# EAGLE design H05R00 (EAGLE 9.6.2)

## Sheet 1 of 2
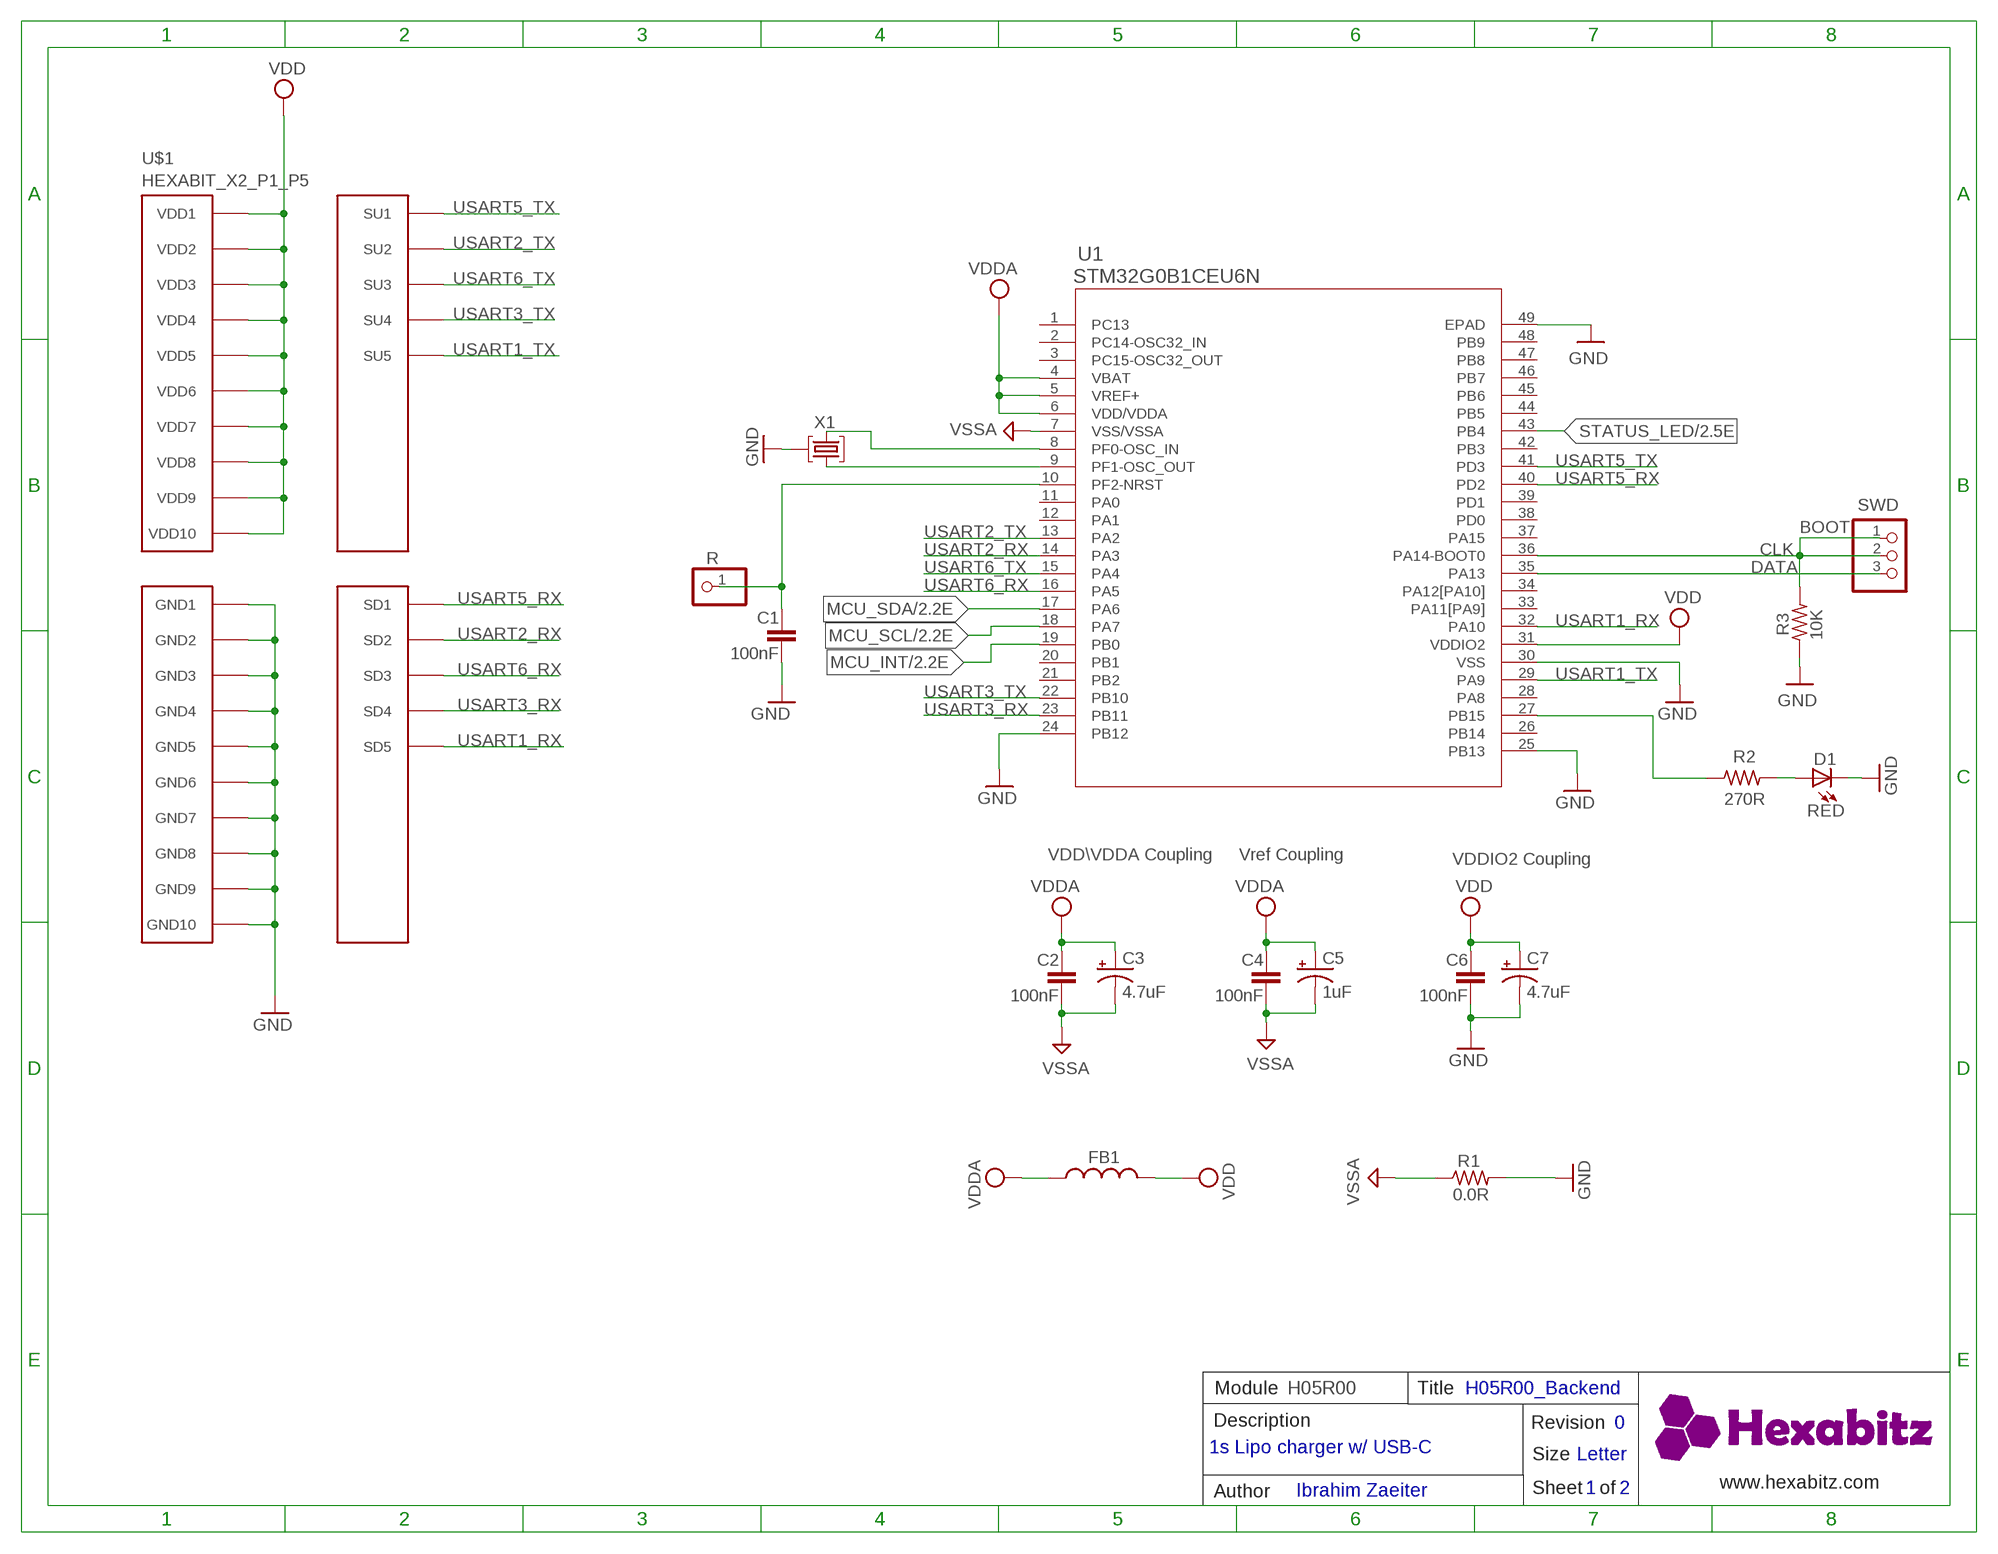
[diagram p0: schematic, sheet 1]

### Parts
C1  100nF  C-0603  [C-0603]
C2  100nF  C-0603  [C-0603]
C3  4.7uF  C-0805-POL  [C-0805-POL]
C4  100nF  C-0603  [C-0603]
C5  1uF  C-0805-POL  [C-0805-POL]
C6  100nF  C-0603  [C-0603]
C7  4.7uF  C-0805-POL  [C-0805-POL]
D1  RED  VLMS1300-GS08  [VLMS1300-GS08]
FB1  FB-0603  [FB-0603]
R  R  PINHD-1X1  [1X01]
R1  0.0R  R-0603  [R-0603]
R2  270R  R-0603  [R-0603]
R3  10K  R-0603  [R-0603]
SWD  PINHD-1X3  [1X03]
U1  STM32G0B1CEU6N  [HEXABITZ_ICS_QFN_B1CEU6_STM-L]
U$1  HEXABIT_X2_P1_P5  [HEXABIT_17.32_X2_P1_P5]
X1  XTALL_CSTCE8M00G52  [XTALL_CSTCE8M00G52]

### Nets
CLK: R3.2 SWD.1 SWD.2 U1.36(PA14-BOOT0)
DATA: SWD.3 U1.35(PA13)
GND: C1.2 C6.2 C7.2(-) D1.C R1.2 R3.1 U1.24(PB12) U1.25(PB13) U1.30(VSS) U1.49(EPAD) U$1.PAD_PD11(GND1) U$1.PAD_PD12(GND2) U$1.PAD_PD13(GND3) U$1.PAD_PD14(GND4) U$1.PAD_PD15(GND5) U$1.PAD_PD16(GND6) U$1.PAD_PD17(GND7) U$1.PAD_PD18(GND8) U$1.PAD_PD19(GND9) U$1.PAD_PD20(GND10) X1.P$2 ; also sheet 2
MCU_INT: U1.19(PB0) ; also sheet 2
MCU_SCL: U1.18(PA7) ; also sheet 2
MCU_SDA: U1.17(PA6) ; also sheet 2
N$1: D1.A R2.2
N$2: R2.1 U1.27(PB15)
N$5: U1.9(PF1-OSC_OUT) X1.P$1
N$6: U1.8(PF0-OSC_IN) X1.P$3
N$8: C1.1 R.1 U1.10(PF2-NRST)
STATUS_LED: U1.43(PB4) ; also sheet 2
USART1_RX: U1.32(PA10) U$1.PAD_PD5(SD5)
USART1_TX: U1.29(PA9) U$1.PAD_PU5(SU5)
USART2_RX: U1.14(PA3) U$1.PAD_PD2(SD2)
USART2_TX: U1.13(PA2) U$1.PAD_PU2(SU2)
USART3_RX: U1.23(PB11) U$1.PAD_PD4(SD4)
USART3_TX: U1.22(PB10) U$1.PAD_PU4(SU4)
USART5_RX: U1.40(PD2) U$1.PAD_PD1(SD1)
USART5_TX: U1.41(PD3) U$1.PAD_PU1(SU1)
USART6_RX: U1.16(PA5) U$1.PAD_PD3(SD3)
USART6_TX: U1.15(PA4) U$1.PAD_PU3(SU3)
VDD: C6.1 C7.1(+) FB1.2 U1.31(VDDIO2) U$1.PAD_PU11(VDD1) U$1.PAD_PU12(VDD2) U$1.PAD_PU13(VDD3) U$1.PAD_PU14(VDD4) U$1.PAD_PU15(VDD5) U$1.PAD_PU16(VDD6) U$1.PAD_PU17(VDD7) U$1.PAD_PU18(VDD8) U$1.PAD_PU19(VDD9) U$1.PAD_PU20(VDD10) ; also sheet 2
VDDA: C2.1 C3.1(+) C4.1 C5.1(+) FB1.1 U1.4(VBAT) U1.5(VREF+) U1.6(VDD/VDDA)
VSSA: C2.2 C3.2(-) C4.2 C5.2(-) R1.1 U1.7(VSS/VSSA) ; also sheet 2
Unconnected: U1.1(PC13) U1.2(PC14-OSC32_IN) U1.3(PC15-OSC32_OUT) U1.11(PA0) U1.12(PA1) U1.20(PB1) U1.21(PB2) U1.26(PB14) U1.28(PA8) U1.33(PA11[PA9]) U1.34(PA12[PA10]) U1.37(PA15) U1.38(PD0) U1.39(PD1) U1.42(PB3) U1.44(PB5) U1.45(PB6) U1.46(PB7) U1.47(PB8) U1.48(PB9)

### Notes on the sheet
- BOOT
- VDD\VDDA Coupling | Vref Coupling | VDDIO2 Coupling
- Module | H05R00 | Title | H05R00_Backend
- Description | Revision | 0
- 1s Lipo charger w/ USB-C
- Size | Letter
- www.hexabitz.com
- Author | Ibrahim Zaeiter | Sheet   of | 1 | 2
- C:/Users/Admin/Desktop/logodraft.bmp

## Sheet 2 of 2
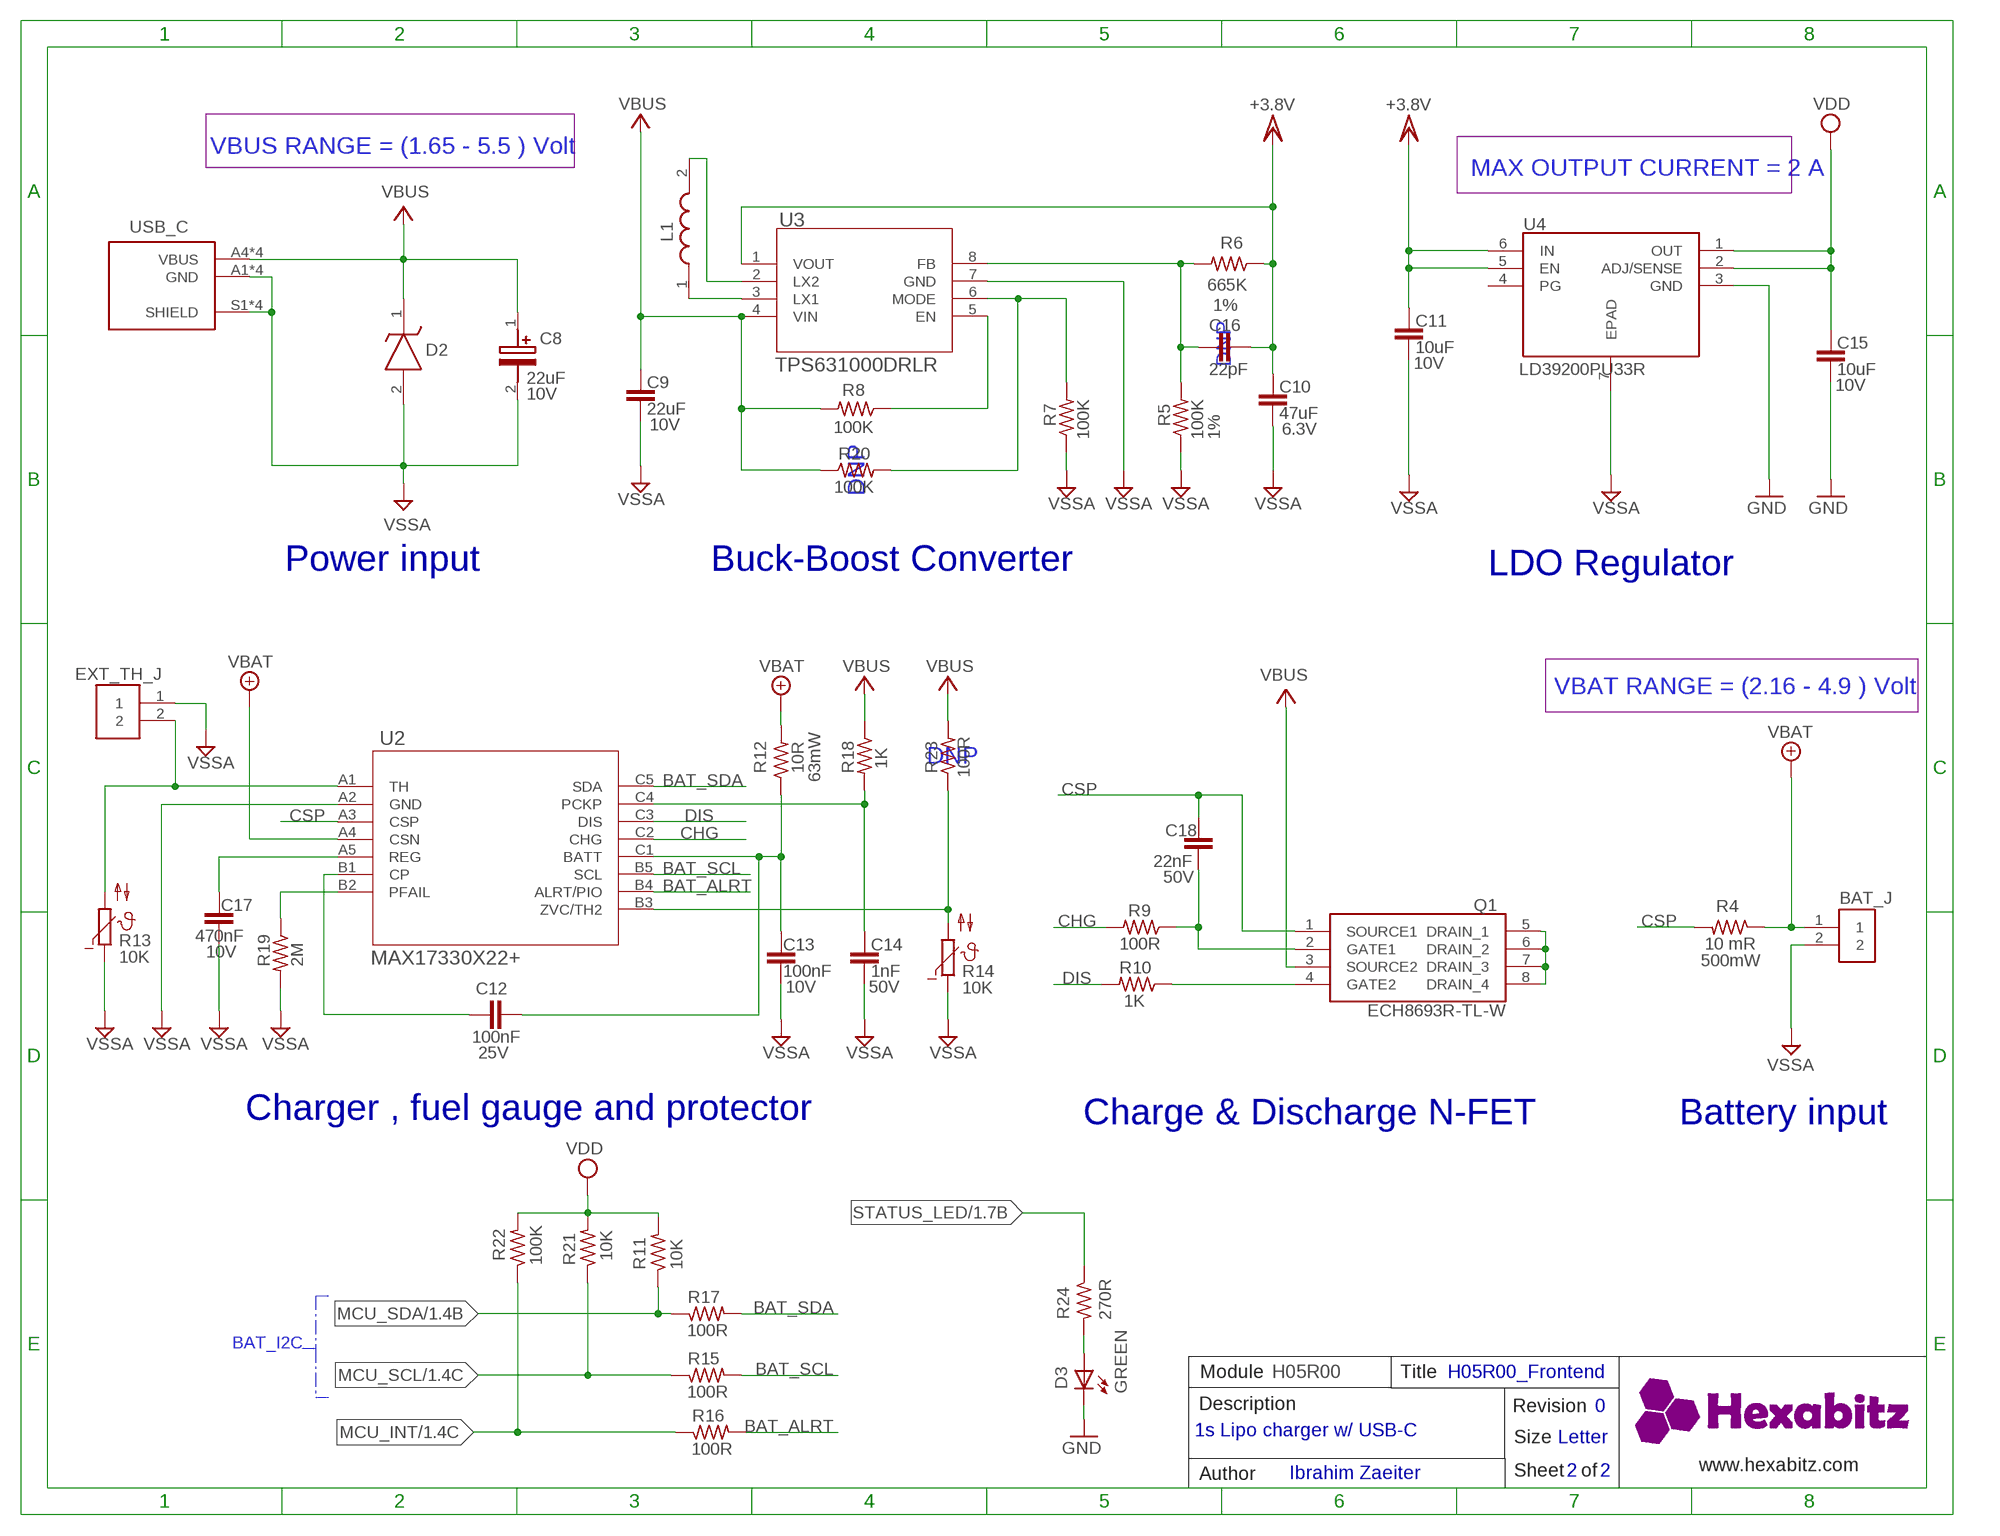
[diagram p1: schematic, sheet 2]

### Parts
BAT_J  B2B-PH-K-S(LF)(SN)  [JST_B2B-PH-K-S(LF)(SN)]
C8  22uF  T491B226K010AT  [T491B]
C9  22uF  C-0603  [C-0603]
C10  47uF  C-0603  [C-0603]
C11  10uF  C-0603  [C-0603]
C12  100nF  C-0603  [C-0603]
C13  100nF  C-0603  [C-0603]
C14  1nF  C-0603  [C-0603]
C15  10uF  C-0603  [C-0603]
C16  22pF  C-0603  [C-0603]
C17  470nF  C-0603  [C-0603]
C18  22nF  C-0603  [C-0603]
D2  UCLAMP0501H.TCT  [SODFL1608X70N]
D3  GREEN  VLMS1300-GS08  [VLMS1300-GS08]
EXT_TH_J  3-644456-2  [TE_3-644456-2]
L1  DFE252012P-1R0M=P2  [DFE2HCAH1R0MJ0L]
Q1  ECH8693R-TL-W  [SOTFL65P280X95-8N]
R4  10 mR  R-0805  [R-0805]
R5  100K  R-0603  [R-0603]
R6  665K  R-0603  [R-0603]
R7  100K  R-0603  [R-0603]
R8  100K  R-0603  [R-0603]
R9  100R  R-0603  [R-0603]
R10  1K  R-0603  [R-0603]
R11  10K  R-0603  [R-0603]
R12  10R  R-0603  [R-0603]
R13  10K  NCP18XH103F03RBNCP18XH103F03RB  [R-0603]
R14  10K  NCP18XH103F03RBNCP18XH103F03RB  [R-0603]
R15  100R  R-0603  [R-0603]
R16  100R  R-0603  [R-0603]
R17  100R  R-0603  [R-0603]
R18  1K  R-0603  [R-0603]
R19  2M  R-0603  [R-0603]
R20  100K  R-0603  [R-0603]
R21  10K  R-0603  [R-0603]
R22  100K  R-0603  [R-0603]
R23  DNP  R-0603  [R-0603]
R24  270R  R-0603  [R-0603]
U2  MAX17330X22+  MAX17330X22+21-100433_W151J2+1_MXM  [21-100433_W151J2+1_MXM]
U3  TPS631000DRLR  TPS631000DRLRTPS631000DRLR_TEX  [TPS631000DRLR_TEX]
U4  LD39200PU33R  [SON95P300X300X100-7N]
USB_C  UJC-HP-G-SMT-TR  [CUI_UJC-HP-G-SMT-TR]

### Nets
+3.8V: C10.2 C11.2 C16.1 R6.1 U3.1(VOUT) U4.5(EN) U4.6(IN)
BAT_ALRT: R16.2 U2.B4(ALRT/PIO)
BAT_SCL: R15.2 U2.B5(SCL)
BAT_SDA: R17.2 U2.C5(SDA)
CHG: R9.2 U2.C2(CHG)
CSP: C18.1 Q1.1(SOURCE1) R4.2 U2.A3(CSP)
DIS: R10.2 U2.C3(DIS)
GND: C15.1 D3.C U4.3(GND) ; also sheet 1
MCU_INT: R16.1 R22.1 ; also sheet 1
MCU_SCL: R15.1 R21.1 ; also sheet 1
MCU_SDA: R11.1 R17.1 ; also sheet 1
N$3: D3.A R24.2
N$7: R19.1 U2.B2(PFAIL)
N$9: Q1.5(DRAIN_1) Q1.6(DRAIN_2) Q1.7(DRAIN_3) Q1.8(DRAIN_4)
N$10: C18.2 Q1.2(GATE1) R9.1
N$11: L1.2 U3.2(LX2)
N$12: L1.1 U3.3(LX1)
N$13: R7.2 R20.2 U3.6(MODE)
N$15: Q1.4(GATE2) R10.1
N$17: R14.2 R23.1 U2.B3(ZVC/TH2)
N$18: EXT_TH_J.2 R13.2 U2.A1(TH)
N$19: C17.2 U2.A5(REG)
N$20: C12.1 U2.B1(CP)
N$21: C12.2 C13.1 R12.1 U2.C1(BATT)
N$26: C14.1 R18.2 U2.C4(PCKP)
N$27: C16.2 R5.2 R6.2 U3.8(FB)
N$28: R8.1 U3.5(EN)
STATUS_LED: R24.1 ; also sheet 1
VBAT: BAT_J.1 R4.1 R12.2 U2.A4(CSN)
VBUS: C8.1(+) C9.2 D2.1(K) Q1.3(SOURCE2) R8.2 R18.1 R20.1 R23.2 U3.4(VIN) USB_C.A4(VBUS) USB_C.A9(VBUS) USB_C.B4(VBUS) USB_C.B9(VBUS)
VDD: C15.2 R11.2 R21.2 R22.2 U4.1(OUT) U4.2(ADJ/SENSE) ; also sheet 1
VSSA: BAT_J.2 C8.2(-) C9.1 C10.1 C11.1 C13.2 C14.2 C17.1 D2.2(A) EXT_TH_J.1 R5.1 R7.1 R13.1 R14.1 R19.2 U2.A2(GND) U3.7(GND) U4.7(EPAD) USB_C.A1(GND) USB_C.A12(GND) USB_C.B1(GND) USB_C.B12(GND) USB_C.S1(SHIELD) USB_C.S2(SHIELD) USB_C.S3(SHIELD) USB_C.S4(SHIELD) ; also sheet 1
Unconnected: U4.4(PG)

### Notes on the sheet
- VBUS RANGE = (1.65 - 5.5 ) Volt
- MAX OUTPUT CURRENT = 2 A
- Power input | Buck-Boost Converter | LDO Regulator
- VBAT RANGE = (2.16 - 4.9 ) Volt
- Charger , fuel gauge and protector | Charge & Discharge N-FET | Battery input
- BAT_I2C
- Module | H05R00 | Title | H05R00_Frontend
- Description | Revision | 0
- 1s Lipo charger w/ USB-C
- Size | Letter
- www.hexabitz.com
- Author | Ibrahim Zaeiter | Sheet   of | 2 | 2
- C:/Users/Admin/Desktop/logodraft.bmp

## Library data of the parts
BAT_J = HEXABITZ_CONNECTION_PARTS:B2B-PH-K-S(LF)(SN): PH Series 2 Position 2 mm Pitch Through Hole Top Entry Shrouded Header Check availability <https://pricing.snapeda.com/parts/B2B-PH-K-S%28LF%29%28SN%29/JST%20Sales/view-part?ref=eda>; AVAILABILITY: In Stock; DESCRIPTION: Connector Header Through Hole 2 position 0.079 (2.00mm); MF: JST Sales; MP: B2B-PH-K-S(LF)(SN); PACKAGE: None; PRICE: None; PURCHASE-URL: https://pricing.snapeda.com/search?q=B2B-PH-K-S(LF)(SN)&ref=eda
C1 C2 C4 C6 = HEXABITZ_RCLS:C-0603: CAP CER 10% X7R 0603
C3 C5 C7 = HEXABITZ_RCLS:C-0805-POL: Cap Tant Solid SMD 2012
C8 = HEXABITZ_RCLS:T491B226K010AT: T491, Tantalum, MnO2 Tantalum, Commercial Grade, 22 uF, 10%, 10 VDC, 125C, -55C, 85C, SMD, MnO2, Molded, 6 % , 2 Ohms, 2200 nA, 107.45 mg, 3528, 1.9mm, Height Max = 2.1mm, 2000, 156 Weeks Source: Datasheet <https://content.kemet.com/datasheets/KEM_T2005_T491.pdf>; DESCRIPTION: T491, Tantalum, MnO2 Tantalum, Commercial Grade, 22 uF, 10%, 10 VDC, 125C, -55C, 85C, SMD, MnO2, Molded, 6 % , 2 Ohms, 2200 nA, 107.45 mg, 3528, 1.9mm, Height Max = 2.1mm, 2000, 156 Weeks; HEIGHT: 2.1mm; MANUFACTURER_NAME: KEMET; MANUFACTURER_PART_NUMBER: T491B226K010AT; MOUSER_PART_NUMBER: 80-T491B226K010; MOUSER_PRICE-STOCK: https://www.mouser.co.uk/ProductDetail/KEMET/T491B226K010AT?qs=jcsBHvPDQt%2FPWsVfmUrYhw%3D%3D; VOLTAGE: 10V
C9 C11 C15 = HEXABITZ_RCLS:C-0603: CAP CER 10% X7R 0603; MPN: GRM187R61A226ME15; VOLTAGE_RATING: 10V
C10 = HEXABITZ_RCLS:C-0603: CAP CER 10% X7R 0603; MPN: CL10A476MQ8QRN; VOLTAGE_RATING: 6.3V
C12 = HEXABITZ_RCLS:C-0603: CAP CER 10% X7R 0603; VOLTAGE_RATING: 25V
C13 C17 = HEXABITZ_RCLS:C-0603: CAP CER 10% X7R 0603; VOLTAGE_RATING: 10V
C14 C18 = HEXABITZ_RCLS:C-0603: CAP CER 10% X7R 0603; VOLTAGE_RATING: 50V
C16 = HEXABITZ_RCLS:C-0603: CAP CER 10% X7R 0603; STATE: DNP
D1 = Hexabitz:VLMS1300-GS08: Red 0603 130° Clear 54 mcd 2 V Surface Mount ChipLED ; Octopart Url : http://octopart.com/vlms1300-gs08-vishay-21709201; MFN: Vishay; MPN: VLMS1300-GS08; OCTOPART_URL: https://octopart.com/vlms1300-gs08-vishay-21709201?r=sp&s=_gcP4_q8T1SC6PJQPTQ9yA
D2 = HEXABITZ_RCLS:UCLAMP0501H.TCT: SEMTECH - UCLAMP0501H.TCT - TVS DIODE, 240W, 5V, SOD-523, FULL REEL Source: Datasheet <https://datasheet.datasheetarchive.com/originals/distributors/Datasheets-30/DSA-588575.pdf>; DESCRIPTION: SEMTECH - UCLAMP0501H.TCT - TVS DIODE, 240W, 5V, SOD-523, FULL REEL; HEIGHT: 0.7mm; MANUFACTURER_NAME: SEMTECH; MANUFACTURER_PART_NUMBER: UCLAMP0501H.TCT; MOUSER_PART_NUMBER: 947-UCLAMP0501H.TCT; MOUSER_PRICE-STOCK: https://www.mouser.co.uk/ProductDetail/Semtech/UCLAMP0501H.TCT?qs=rBWM4%252BvDhIf5bhuPjughFg%3D%3D
D3 = Hexabitz:VLMS1300-GS08: Red 0603 130° Clear 54 mcd 2 V Surface Mount ChipLED ; Octopart Url : http://octopart.com/vlms1300-gs08-vishay-21709201; MFN: Vishay; MPN: VLMS1300-GS08; OCTOPART_URL: https://octopart.com/vlms1300-gs08-vishay-21709201?r=sp&s=_gcP4_q8T1SC6PJQPTQ9yA; VALUE: RED
EXT_TH_J = HEXABITZ_USER_INTERFACE_PARTS:3-644456-2; AVAILABILITY: Unavailable; CENTERLINE_PITCH: 2.54 mm[.1 in]; COMMENT: 3-644456-2; DESCRIPTION: Connector Unshrouded Header HDR 2 Position 2.54mm Solder Straight Thru-Hole; EU_ROHS_COMPLIANCE: Compliant; MF: TE Connectivity; MFN: TE Connectivity; MP: 3-644456-2; MPN: 87224-1; NUMBER_OF_POSITIONS: 2; OCTOPART_URL: https://octopart.com/87224-1-te+connectivity-39512011?r=sp; PACKAGE: None; PRICE: None; PRODUCT_TYPE: Connector; TE_PURCHASE_URL: https://www.te.com/usa-en/product-3-644456-2.html?te_bu=Cor&te_type=disp&te_campaign=seda_glo_cor-seda-global-disp-prtnr-fy19-seda-model-bom-cta_sma-317_1&elqCampaignId=32493
FB1 = HEXABITZ_RCLS:FB-0603: Ferrite Beads Multi-Layer 0603
L1 = HEXABITZ_RCLS:DFE252012P-1R0M=P2: Toko DFE252012P Series Shielded Wire-wound SMD Inductor with a Powered Iron Core, 1 uH Wire-Wound 4.8A Idc Source: Datasheet <https://psearch.en.murata.com/inductor/product/DFE252012P-1R0M#.html>; DESCRIPTION: Toko DFE252012P Series Shielded Wire-wound SMD Inductor with a Powered Iron Core, 1 uH Wire-Wound 4.8A Idc; HEIGHT: 1.2mm; MANUFACTURER_NAME: Murata Electronics; MANUFACTURER_PART_NUMBER: DFE252012P-1R0M=P2; MOUSER_PART_NUMBER: 81-DFE252012P-1R0MP2; MOUSER_PRICE-STOCK: https://www.mouser.co.uk/ProductDetail/Murata-Electronics/DFE252012P-1R0M%3dP2?qs=KuGPmAKtFKUHla8Odvjl9w%3D%3D
Q1 = HEXABITZ_RCLS:ECH8693R-TL-W: ON SEMICONDUCTOR - ECH8693R-TL-W - MOSFET, DUAL N-CH, 24V, 14A, SOT-28FL Source: Datasheet <http://www.onsemi.com/pub/Collateral/ECH8693R-D.PDF>; DESCRIPTION: ON SEMICONDUCTOR - ECH8693R-TL-W - MOSFET, DUAL N-CH, 24V, 14A, SOT-28FL; HEIGHT: 0.95mm; MANUFACTURER_NAME: onsemi; MANUFACTURER_PART_NUMBER: ECH8693R-TL-W; MOUSER_PART_NUMBER: 863-ECH8693R-TL-W; MOUSER_PRICE-STOCK: https://www.mouser.co.uk/ProductDetail/onsemi/ECH8693R-TL-W?qs=Tr3lMbyRyKkLUc9md0qy2g%3D%3D
R = HEXABITZ_USER_INTERFACE_PARTS:PINHD-1X1: PIN HEADER; MFN: TE Connectivity; MPN: 87227-1; OCTOPART_URL: https://octopart.com/87227-1-te+connectivity-39512052?r=sp
R1-R3 R7-R11 R15-R19 R21 R22 R24 = HEXABITZ_RCLS:R-0603: Thick Film Resistors - SMD 0603
R4 = HEXABITZ_RCLS:R-0805: Thick Film Resistors - SMD 0605; POWR: 500mW
R5 R6 = HEXABITZ_RCLS:R-0603: Thick Film Resistors - SMD 0603; TOLERANCE: 1%
R12 = HEXABITZ_RCLS:R-0603: Thick Film Resistors - SMD 0603; POWER: 63mW
R13 R14 = HEXABITZ_RCLS:NCP18XH103F03RB: SIEMENS NTC; MPN: NCP18XH103F03RB
R20 = HEXABITZ_RCLS:R-0603: Thick Film Resistors - SMD 0603; STATE: DNP
R23 = HEXABITZ_RCLS:R-0603: Thick Film Resistors - SMD 0603; RESISTANCE: 100R; STATE: DNP
SWD = pinhead:PINHD-1X3: PIN HEADER
U1 = HEXABITZ_ICs:STM32G0B1CEU6N
U2 = HEXABITZ_ICs:MAX17330X22+; COPYRIGHT: Copyright (C) 2023 Ultra Librarian. All rights reserved.; MANUFACTURER_PART_NUMBER: MAX17330X22+; MFR_NAME: Analog Devices Inc
U3 = HEXABITZ_ICs:TPS631000DRLR; COPYRIGHT: Copyright (C) 2023 Ultra Librarian. All rights reserved.; MANUFACTURER_PART_NUMBER: TPS631000DRLR; MFR_NAME: Texas Instruments
U4 = HEXABITZ_ICs:LD39200PU33R: LDO Voltage Regulators 2 A high PSRR ultra low drop linear regulator with reverse current protection Source: Datasheet <https://www.st.com/resource/en/datasheet/ld39200.pdf>; DESCRIPTION: LDO Voltage Regulators 2 A high PSRR ultra low drop linear regulator with reverse current protection; HEIGHT: 1mm; MANUFACTURER_NAME: STMicroelectronics; MANUFACTURER_PART_NUMBER: LD39200PU33R; MOUSER_PART_NUMBER: 511-LD39200PU33R; MOUSER_PRICE-STOCK: https://www.mouser.co.uk/ProductDetail/STMicroelectronics/LD39200PU33R?qs=WHlX%252B%252B9%2FRwAl6%2FJDqRS1uw%3D%3D
U$1 = hexabitz_connectors:HEXABIT_X2_P1_P5
USB_C = HEXABITZ_CONNECTION_PARTS:UJC-HP-G-SMT-TR: Check availability <https://pricing.snapeda.com/parts/UJC-HP-G-SMT-TR/CUI%20Devices/view-part?ref=eda>; AVAILABILITY: In Stock; CHECK_PRICES: https://www.snapeda.com/parts/UJC-HP-G-SMT-TR/CUI+Devices/view-part/?ref=eda; CUI_PURCHASE_URL: https://www.cuidevices.com/product/interconnect/connectors/usb-connectors/ujc-hp-g-smt-tr?utm_source=snapeda.com&utm_medium=referral&utm_campaign=snapedaBOM; DESCRIPTION: Type C, 20 Vdc, 5 A, Right Angle, Surface Mount, Power-Only USB Receptacle; MF: CUI Devices; MP: UJC-HP-G-SMT-TR; PACKAGE: None; PRICE: None; PURCHASE-URL: https://www.snapeda.com/api/url_track_click_mouser/?unipart_id=5162954&manufacturer=CUI Devices&part_name=UJC-HP-G-SMT-TR&search_term= ujc-hp-g-smt-tr; SNAPEDA_LINK: https://www.snapeda.com/parts/UJC-HP-G-SMT-TR/CUI+Devices/view-part/?ref=snap
X1 = Hexabitz:XTALL_CSTCE8M00G52: MURATA CSTCE8M00G52-R0 RESONATOR, SMD, 8MHZ ; Octopart Url : https://octopart.com/cstce8m00g52-r0-murata-7145559; MFN: Murata; MPN: CSTCE8M00G52Z-R0; OCTOPART_URL: https://octopart.com/cstce8m00g52z-r0-murata-17755941?r=sp&s=JDnNJnrHQhyS8Zk4ofFWXw

## Board
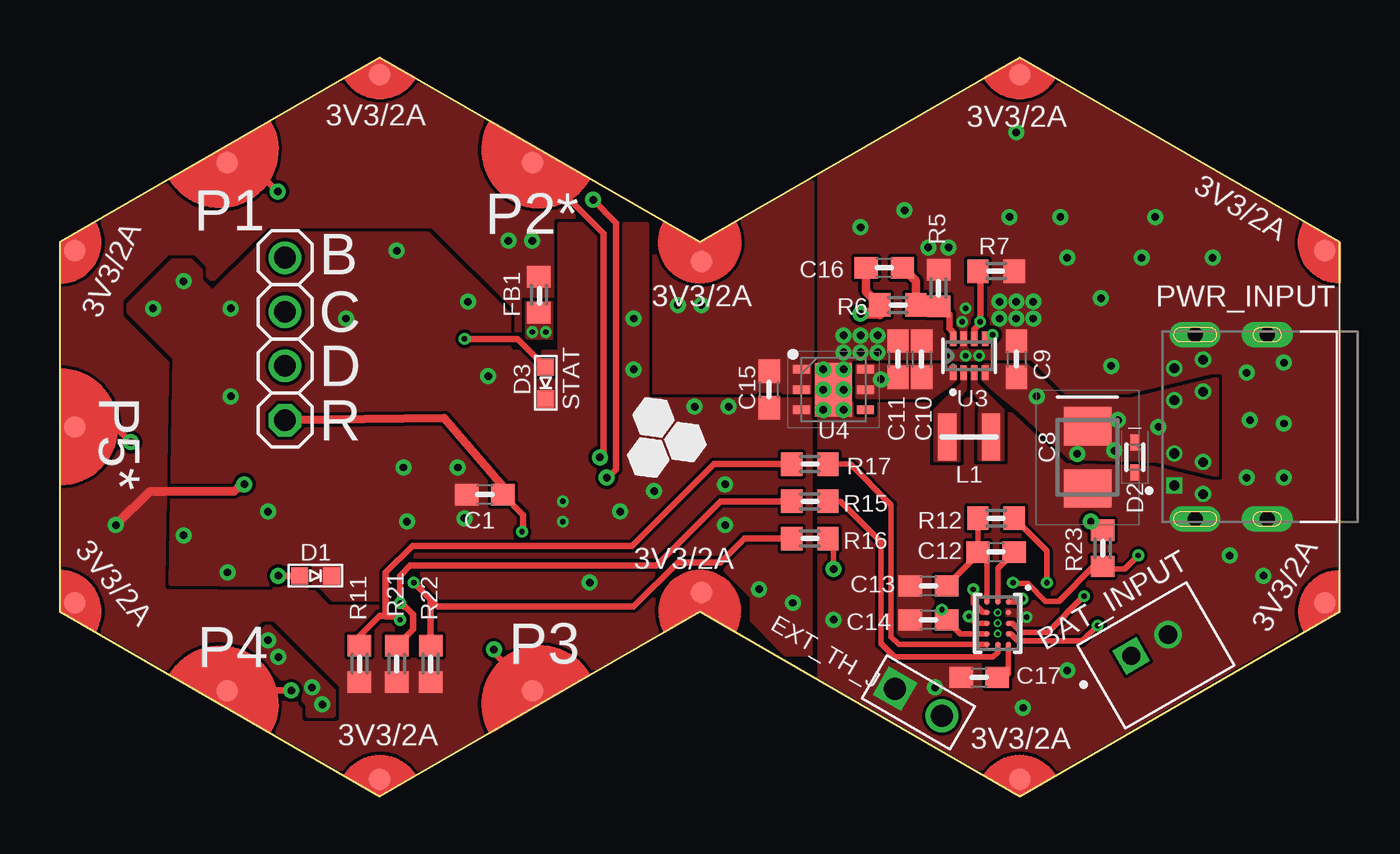
[diagram p2: board, top side]
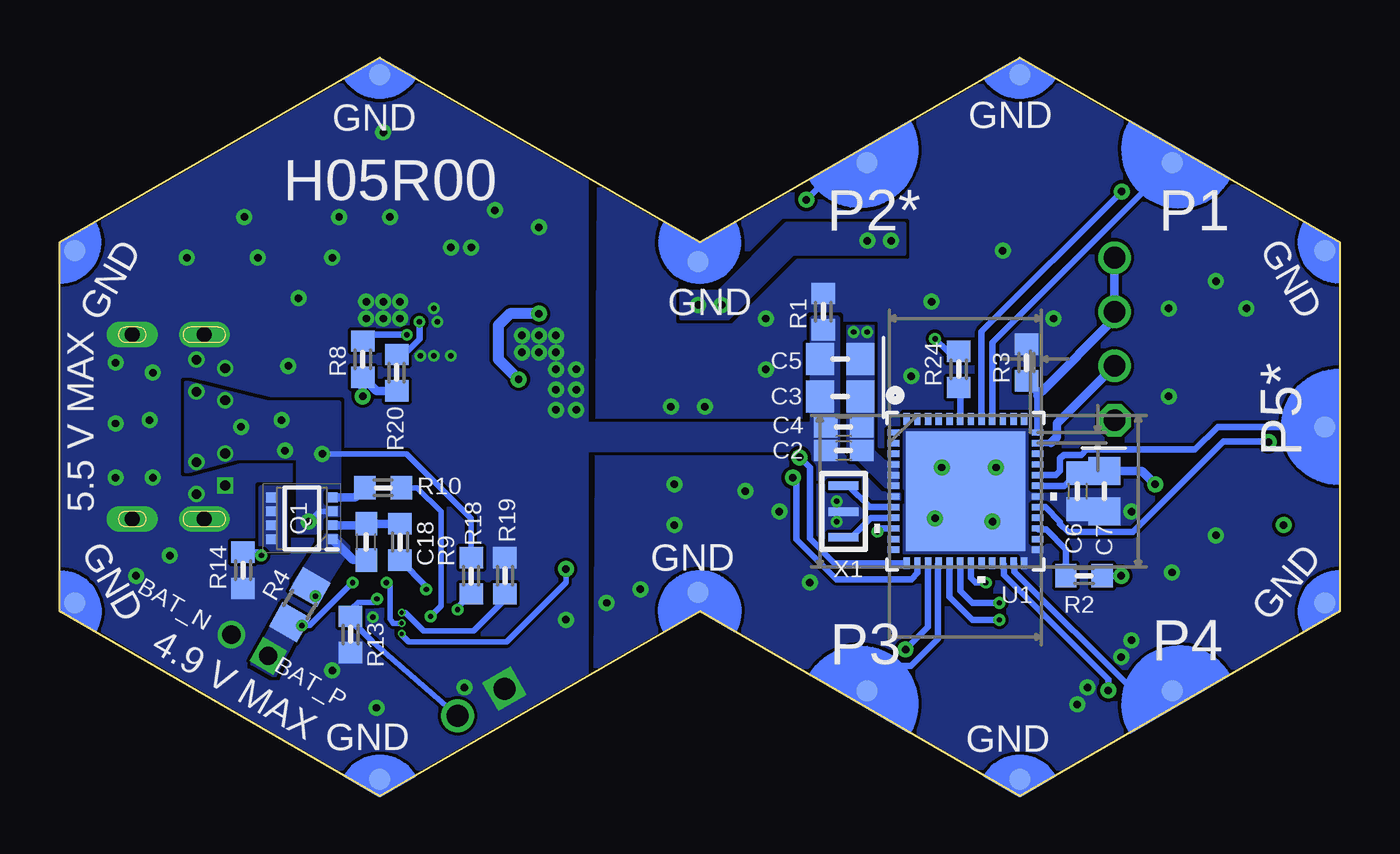
[diagram p3: board, bottom side, seen from below]

Size 60 x 34.64 mm. Coordinates in mm from the lower left corner, seen from the top.
Copper layers (1*16): Top 0.035mm / dielectric 1.5mm / Bottom 0.035mm
Design rules "default1 *": minimum track width 10mil, minimum drill 0.2mm, track to track 6mil, track to pad 6mil, pad to pad 6mil, via to via 5mil, smd to smd 0mil, copper to edge 1mil, drill to drill 6mil, minimum pad ring 6mil, minimum via ring 3mil, stop-mask expansion 4mil, vias tented up to drill 24mil, thermal gap 10mil

### Footprints (pad centres in the part's own frame; a part is rotated, then mirrored left to right if it is on the bottom)
JST_B2B-PH-K-S(LF)(SN) = drill 0.86 square: 1 1,-0.55 | drill 0.86: 2 -1,-0.55
C-0603 = smd 1.1 x 1: 1 -0.85,0; 2 0.85,0
C-0805-POL = smd 1.3 x 1.5: 1 -0.95,0; 2 0.95,0
T491B = smd 1.8 x 2.23: 1 -1.46,0; 2 1.46,0
VLMS1300-GS08 = smd 0.8 x 0.8: A 0,0.75; C 0,-0.75
SODFL1608X70N = smd 0.75 x 0.42: 1 -0.7,0; 2 0.7,0
TE_3-644456-2 = drill 1.02 pad 1.37 square: 1 0,0 | drill 1.02 pad 1.37: 2 2.54,0
FB-0603 = smd 1 x 1.1: 1 -0.85,0; 2 0.85,0
DFE2HCAH1R0MJ0L = smd 0.85 x 2.2: 1 -1.025,0; 2 1.025,0
SOTFL65P280X95-8N = smd 0.515 x 0.45: 1 -1.408,0.975; 2 -1.408,0.325; 3 -1.408,-0.325; 4 -1.408,-0.975; 5 1.408,-0.975; 6 1.408,-0.325; 7 1.408,0.325; 8 1.408,0.975
1X01 = drill 1.016 octagon: 1 0,0
R-0603 = smd 1 x 1.1: 1 -0.85,0; 2 0.85,0
R-0805 = smd 1.3 x 1.5: 1 -0.95,0; 2 0.95,0
1X03 = drill 1.016: 1 -2.54,0; 2 0,0; 3 2.54,0
HEXABITZ_ICS_QFN_B1CEU6_STM-L = smd 0.55 x 0.297: 1 -3.38,2.751; 2 -3.38,2.251; 3 -3.38,1.75; 4 -3.38,1.25; 5 -3.38,0.75; 6 -3.38,0.25; 7 -3.38,-0.25; 8 -3.38,-0.75; 9 -3.38,-1.25; 10 -3.38,-1.75; 11 -3.38,-2.251; 12 -3.38,-2.751; 25 3.38,-2.751; 26 3.38,-2.251; 27 3.38,-1.75; 28 3.38,-1.25; 29 3.38,-0.75; 30 3.38,-0.25; 31 3.38,0.25; 32 3.38,0.75; 33 3.38,1.25; 34 3.38,1.75; 35 3.38,2.251; 36 3.38,2.751 | smd 0.297 x 0.55: 13 -2.751,-3.38; 14 -2.251,-3.38; 15 -1.75,-3.38; 16 -1.25,-3.38; 17 -0.75,-3.38; 18 -0.25,-3.38; 19 0.25,-3.38; 20 0.75,-3.38; 21 1.25,-3.38; 22 1.75,-3.38; 23 2.251,-3.38; 24 2.751,-3.38; 37 2.751,3.38; 38 2.251,3.38; 39 1.75,3.38; 40 1.25,3.38; 41 0.75,3.38; 42 0.25,3.38; 43 -0.25,3.38; 44 -0.75,3.38; 45 -1.25,3.38; 46 -1.75,3.38; 47 -2.251,3.38; 48 -2.751,3.38 | smd 5.6 x 5.6: 49 0,0
21-100433_W151J2+1_MXM = smd 0.254 x 0.254: A1 -1,0.5; A2 -0.5,0.5; A3 0,0.5; A4 0.5,0.5; A5 1,0.5; B1 -1,0; B2 -0.5,0; B3 0,0; B4 0.5,0; B5 1,0; C1 -1,-0.5; C2 -0.5,-0.5; C3 0,-0.5; C4 0.5,-0.5; C5 1,-0.5
TPS631000DRLR_TEX = smd 0.67 x 0.3: 1 -0.8,0.75; 2 -0.8,0.25; 3 -0.8,-0.25; 4 -0.8,-0.75; 5 0.8,-0.75; 6 0.8,-0.25; 7 0.8,0.25; 8 0.8,0.75
SON95P300X300X100-7N = smd 0.8 x 0.4: 1 -1.5,0.95; 2 -1.5,0; 3 -1.5,-0.95; 4 1.5,-0.95; 5 1.5,0; 6 1.5,0.95 | smd 1.75 x 2.5: 7 0,0
HEXABIT_17.32_X2_P1_P5 = smd 1 x 1 bottom: PAD_PD1 12.39,22.39; PAD_PD2 12.39,8.09; PAD_PD3 -12.39,8.09; PAD_PD4 -12.39,22.39; PAD_PD5 0,29.55; PAD_PD12 16.52,15.24; PAD_PD13 7.752,0.168; PAD_PD14 16.52,-14.76; PAD_PD15 8.26,-29.07; PAD_PD16 -8.26,-29.07; PAD_PD17 -16.52,-14.76; PAD_PD18 -7.752,0.168; PAD_PD19 -16.52,15.24 | smd 1 x 1 rotated 60 bottom: PAD_PD11 8.26,29.547 | smd 1 x 1 rotated 120 bottom: PAD_PD20 -8.26,29.547 | smd 1 x 1: PAD_PU1 12.39,22.39; PAD_PU2 12.39,8.09; PAD_PU3 -12.39,8.09; PAD_PU4 -12.39,22.39; PAD_PU5 0,29.55; PAD_PU12 16.52,15.24; PAD_PU13 7.752,0.168; PAD_PU14 16.52,-14.76; PAD_PU15 8.26,-29.07; PAD_PU16 -8.26,-29.07; PAD_PU17 -16.52,-14.76; PAD_PU18 -7.752,0.168; PAD_PU19 -16.52,15.24 | smd 1 x 1 rotated 60: PAD_PU11 8.26,29.547 | smd 1 x 1 rotated 120: PAD_PU20 -8.26,29.547
CUI_UJC-HP-G-SMT-TR = drill 0.45 pad 0.75 square: A1 4.025,2.75 | drill 0.45 pad 0.75: A4 4.025,1.25; A9 4.025,-1.25; A12 4.025,-2.75; B1 2.675,-3.15; B4 2.675,-1.65; B9 2.675,1.65; B12 2.675,3.15 | drill 0.7 pad 1.2 long: S1 3.045,4.32; S2 3.045,-4.32; S3 -0.335,4.32; S4 -0.335,-4.32
XTALL_CSTCE8M00G52 = smd 1.4 x 0.4: P$1 0,1.2; P$2 0,0; P$3 0,-1.2

### Placement (x,y rotation side)
BAT_J  51.38,6.6 210 top
C1  19.92,14.15 180 top
C2  23.25,16.21 180 bottom
C3  23.41,18.75 180 bottom
C4  23.25,17.32 180 bottom
C5  23.41,20.5 180 bottom
C6  12.3,14.3 270 bottom
C7  11.03,14.3 270 bottom
C8  48.18,15.89 270 top
C9  44.84,20.5 270 top
C10  40.4,20.5 270 top
C11  39.29,20.5 270 top
C12  43.89,11.45 180 top
C13  40.72,9.86 180 top
C14  40.72,8.27 180 top
C15  33.26,19.07 90 top
C16  38.65,24.78 0 top
C17  43.1,5.57 0 top
C18  45.64,11.92 90 bottom
D1  11.98,10.34 90 top
D2  50.4,15.89 270 top
D3  22.78,19.38 0 top
EXT_TH_J  39.16,5.04 330 top
FB1  22.46,23.51 90 top
L1  42.62,16.84 180 top
Q1  48.66,13.03 180 bottom
R  10.55,17.64 90 top
R1  24.21,22.72 90 bottom
R2  11.98,10.34 0 bottom
R3  14.68,20.34 270 bottom
R4  48.75,8.99 60 bottom
R5  41.19,23.83 270 top
R6  39.29,23.04 0 top
R7  43.89,24.62 180 top
R8  45.8,20.5 270 bottom
R9  44.05,11.92 270 bottom
R10  44.84,14.46 0 bottom
R11  14.05,6.21 270 top
R12  43.89,13.03 0 top
R13  46.37,7.58 90 bottom
R14  51.41,10.59 90 bottom
R15  35.16,13.83 0 top
R16  35.16,12.08 0 top
R17  35.16,15.57 0 top
R18  40.72,10.34 270 bottom
R19  39.13,10.34 90 bottom
R20  44.21,19.86 90 bottom
R21  15.79,6.21 270 top
R22  17.38,6.21 270 top
R23  48.89,11.63 90 top
R24  17.86,20.02 90 bottom
SWD  10.55,22.72 270 top
U1  17.54,14.3 0 bottom
U2  43.98,8.11 270 top
U3  42.62,20.65 90 top
U4  36.27,19.07 0 top
U$1  30.24,17.32 90 top
USB_C  56.27,17.32 180 top
X1  23.25,13.35 180 bottom

### Tracks (layer width: path | path; a pad name or v marks a point on that pad's centre or on a via)
+3.8V  (via drill 0.35 pad 0.75)
  Top 0.406: R6.1 37.8,23.67 C16.1
  Top 0.508: R6.1 38.44,22.63 v37.54,22.63
  Bottom 0.508: v37.54,22.63 38.9,22.63 39.45,22.08 39.45,20.49 v38.49,19.54
  pour Top (rank 2, no thermals): 41.99,20.18 41.99,19.54 40.88,18.75 37.38,18.75 37.38,20.18
BAT_ALRT  (via drill 0.2, 0.35 pad 0.75)
  Top 0.254: v36.27,10.65 36.27,11.82 R16.2
  Bottom 0.254: v36.27,10.65 36.27,10.02 39.06,7.23 43.64,7.23 43.98,7.56 U2.B4
  other vias: 43.98,7.61
BAT_SCL
  Top 0.254: R15.2 36.59,13.83 38.49,11.92 38.49,7.16 39.13,6.52 43.74,6.52 43.98,6.76 U2.B5
BAT_SDA
  Top 0.254: U2.C5 39.34,7.11 38.97,7.48 38.97,13.67 37.07,15.57 R17.2
CHG  (via drill 0.25 pad 0.55)
  Top 0.254: U2.C2 43.28,8.61 42.83,9.06 v42.83,9.7
  Bottom 0.254: v42.83,9.7 42.83,9.85 R9.2
CLK
  Bottom 0.305: U1.36 14.16,18.79
  Bottom 0.406: 14.16,18.79 13.96,18.98 | 13.96,18.98 10.56,22.39 SWD.2 SWD.1 | R3.2 14.18,18.98 13.96,18.98
CSP  (via drill 0.25 pad 0.55)
  Top 0.254: U2.A3 44.66,8.11 45.09,7.68 46.32,7.68 v48.02,9.38
  Bottom 0.254: v48.02,9.38 48.02,9.55 R4.2
  Bottom 0.406: C18.1 46.26,11.07 Q1.1
  pour Bottom (no thermals): 49.02,9.88 47.49,12.24 47.07,12.24 46.47,11.64 47.89,9.38
DATA
  Bottom 0.305: U1.35 13.54,16.55
  Bottom 0.406: 13.54,16.55 13.25,16.84 13.25,17.48 SWD.3
DIS  (via drill 0.25 pad 0.55)
  Top 0.254: U2.C3 42.94,8.11 v42.62,8.43
  Bottom 0.254: v42.62,8.43 42.14,8.91 42.14,13.34 43.26,14.46 R10.2
GND  (via drill 0.25 pad 0.55, 0.35 pad 0.75)
  other vias: 24.84,10.02 18.65,15.42 16.11,15.42 16.27,12.88 18.97,13.03 7.86,10.49 9.76,13.35 5.79,12.24 13.41,22.4 15.79,25.57 20.08,19.7 12.3,4.3 11.82,5.1 10.24,6.53 9.76,7.32 32.78,9.7 34.37,9.07 31.19,14.62 31.19,12.72 23.57,12.88 23.57,13.83 26.27,13.35 27.86,14.3 26.91,22.4 26.91,20.02 29.76,18.27 31.35,18.27 5.79,24.15 4.36,22.88 19.13,23.19 8.02,22.88 8.02,18.75
  pour Bottom (rank 3, no thermals): 34.69,28.59 34.84,5.89 30.08,8.59 15,0.02 0.08,8.75 0.08,25.83 15.06,34.59 29.92,26.05
  pour Top (rank 3, no thermals): 5.22,9.97 5.43,21.92 9.95,26.37 17.22,26.37 21.03,22.56 21.03,20.97 21.19,20.81 23.45,20.81 23.45,26.81 27.52,26.81 27.52,18.59 35.16,18.59 35.16,6.68 34.05,6.68 32.46,8.27 32.46,9.38 31.19,10.65 28.34,10.65 26.91,9.22 24.38,9.31 19.89,9.1 18.69,9.1 18.53,9.26 12.81,9.26 12.17,9.9
  pour Top (no thermals): 11.67,4.3 8.89,7.08 9.76,7.95 12.78,4.94 12.78,3.83 11.67,3.83
  pour Top (no thermals): 7.86,22.88 8.49,22.24 8.49,21.29 8.49,21.13 7.06,19.7 6.27,19.7 3.25,22.72 3.25,23.04 5.32,25.1 6.11,25.1 6.59,24.62 6.59,24.15
  pour Bottom (no thermals): 33.57,27.96 45,34.47 59.93,25.89 59.93,8.59 45,-0.14 44.05,1.6 58.18,9.86 58.18,24.78 45.16,32.4 44.84,32.56 34.21,26.53 33.41,27.8
MCU_INT  (via drill 0.25 pad 0.55)
  Top 0.305: R16.1 32.09,12.08 30.98,10.97 28.97,10.97 26.91,8.91 17.7,8.91 v16.59,10.02 17.38,9.22 R22.1
  Bottom 0.305: v16.59,10.02 17.06,10.02 17.29,10.24 U1.19
MCU_SCL  (via drill 0.25 pad 0.55)
  Top 0.305: R15.1 30.98,13.83 27.96,10.81 16.43,10.81 15.95,10.33 v15.95,9.06 16.14,8.88 16.2,8.88 16.56,8.52 16.56,7.82 R21.1
  Bottom 0.305: v15.95,9.06 17.22,9.06 17.79,9.63 U1.18
MCU_SDA  (via drill 0.25 pad 0.55)
  Top 0.305: R17.1 30.66,15.57 26.83,11.74 16.53,11.74 15.28,10.49 15.28,8.43 15.79,8.43 v15.95,8.27 15.77,8.46 14.99,8.46 14.05,7.52 R11.1
  Bottom 0.305: U1.17 18.29,9.34 17.22,8.27 v15.95,8.27
N$1  (via drill 0.35 pad 0.75)
  Top 0.305: v10.24,10.33 D1.A
  Bottom 0.305: R2.2 v10.24,10.33
N$2
  Bottom 0.305: U1.27 14.11,12.51 13.76,12.51 12.83,11.58 R2.1
N$3  (via drill 0.25 pad 0.55)
  Top 0.305: v18.97,21.45 21.47,21.45 D3.A
  Bottom 0.305: R24.2 18.39,20.87 v18.97,21.45
N$5
  Bottom 0.305: U1.9 21.97,13.05 22.87,12.15 X1.P$1
N$6
  Bottom 0.305: U1.8 22.03,13.55 23.03,14.55 X1.P$3
N$7  (via drill 0.2)
  Bottom 0.254: R19.1 39.13,9.22 40.61,7.74 42.95,7.74 43.82,8.61 U2.B2
  other vias: 43.98,8.61
N$8  (via drill 0.25 pad 0.55)
  Top 0.305: v21.67,12.4 21.72,12.45 21.72,13.19 C1.1
  Top 0.406: R.1 18.01,17.73 20.77,14.51 C1.1
  Bottom 0.305: U1.10 21.51,12.55 v21.67,12.4
N$9
  pour Bottom (no thermals): 49.45,14.46 49.45,11.61 50.56,11.61 50.56,14.46
N$10
  Bottom 0.406: R9.1 C18.2 45.7,12.71 Q1.2
N$11
  pour Top (no thermals): 42.15,15.73 42.15,18.75 42.46,19.07 42.46,20.18 42.3,20.18 42.3,19.38 41.03,18.11 41.03,15.73
N$12
  pour Top (no thermals): 43.1,15.78 43.1,16.21 43.13,18.6 42.78,19.03 42.78,20.18 42.94,20.18 42.94,19.38 44.21,18.11 44.21,15.78
N$13  (via drill 0.25 pad 0.55)
  Top 0.254: 43.15,22.18 43.15,22.39 43.15,22.38 | R7.2 43.15,24.51
  Top 0.305: U3.6 42.87,21.9 43.15,22.18 | 43.15,24.51 43.15,22.39 | v43.15,22.24 43.15,22.38
  Bottom 0.254: 43.66,20.92 43.15,21.44
  Bottom 0.305: R20.2 43.89,20.71 43.68,20.92 43.66,20.92 | v43.15,22.24 43.15,21.44
N$15
  Bottom 0.406: Q1.4 46.15,14.01 R10.1
N$17  (via drill 0.2, 0.25 pad 0.55)
  Top 0.254: v50.56,11.29 49.93,10.65 49.02,10.65 R23.1 48.46,10.78 46.83,9.15 46.2,9.15 45.38,9.97 44.74,9.97 v44.69,10.02
  Bottom 0.254: U2.B3 44.37,8.11 44.53,8.31 44.53,9.86 v44.69,10.02 | v50.56,11.29 50.72,11.44 R14.2
  other vias: 43.98,8.11
N$18  (via drill 0.25 pad 0.55)
  Top 0.254: U2.A1 44.99,9.11 v45.13,9.25
  Bottom 0.254: v45.13,9.25 45.29,9.1 46.02,9.1 46.32,8.8 46.16,8.64 R13.2 46.37,8.21 46.05,7.88 46.05,7.94 45.34,7.24 EXT_TH_J.2
N$19
  Top 0.254: U2.A5 44.48,5.73 C17.2
N$20
  Top 0.254: C12.1 43.98,10.68 U2.B1
N$21
  Top 0.254: U2.C1 43.48,11.01 C12.2 43.04,11.33 | C13.1 43.04,11.33 | R12.1 43.04,11.33
N$26  (via drill 0.25 pad 0.55)
  Top 0.254: U2.C4 42.23,7.61 C14.1 41.57,8.53 v41.35,8.75
  Bottom 0.254: R18.2 41.35,8.85 v41.35,8.75
N$27
  Top 0.305: U3.8 41.87,21.77 41.71,21.93 41.71,22.62 41.35,22.98 R5.2 41.14,23.03 R6.2
  Top 0.406: C16.2 40.14,24.15 R6.2
N$28  (via drill 0.25 pad 0.55)
  Top 0.305: v43.73,21.64 43.56,21.64 U3.5
  Bottom 0.254: R8.1 45.5,21.64
  Bottom 0.305: 45.5,21.64 v43.73,21.64
STATUS_LED
  Bottom 0.305: U1.43 17.79,19.1 R24.1
USART1_RX
  Bottom 0.305: U$1.PAD_PD5 5.71,17.32 6.78,16.25 11.87,16.25 12.11,16.01 12.93,16.01 13.11,15.83 13.11,15.24 13.3,15.05 U1.32
USART1_TX  (via drill 0.35 pad 0.75)
  Top 0.305: U$1.PAD_PU5 2.6,17.32 v3.32,16.6
  Bottom 0.305: U1.29 13.81,13.55 13.11,12.85 13.11,12.78 12.73,12.4 9.68,12.4 5.44,16.64 3.36,16.64 v3.32,16.6
USART2_RX  (via drill 0.35 pad 0.75)
  Top 0.305: v25.64,14.94 25.7,14.94 26.08,15.32 26.08,26.88 v25,27.97
  Bottom 0.305: U1.14 19.79,10.47 20.08,10.18 23.58,10.18 25.46,12.05 25.46,14.76 v25.64,14.94 | v25,27.97 23.5,29.47 23.08,29.71 U$1.PAD_PD2
USART2_TX  (via drill 0.35 pad 0.75)
  Top 0.305: v25.32,15.89 25.48,16.05 25.48,26.38 U$1.PAD_PU2
  Bottom 0.305: U1.13 23.69,10.92 24.84,12.08 24.84,15.41 v25.32,15.89
USART3_RX
  Bottom 0.305: U1.23 15.24,10.88 15.24,10.52 9.65,4.93 U$1.PAD_PD4
USART3_TX  (via drill 0.35 pad 0.75)
  Top 0.305: v10.85,4.96 7.88,4.96 U$1.PAD_PU4
  Bottom 0.305: U1.22 15.75,10.88 15.75,10.38 10.85,5.49 v10.85,4.96
USART5_RX
  Bottom 0.305: U$1.PAD_PD1 16.29,21.27 U1.40
USART5_TX  (via drill 0.35 pad 0.75)
  Top 0.305: v10.22,28.36 8.87,29.71 U$1.PAD_PU1
  Bottom 0.305: U1.41 16.79,21.79 v10.22,28.36
USART6_RX
  Bottom 0.305: U1.16 18.83,10.88 18.83,7.37 20.1,6.11 20.97,6.11 U$1.PAD_PD3
USART6_TX  (via drill 0.35 pad 0.75)
  Top 0.305: U$1.PAD_PU3 20.35,6.73 v20.35,6.87
  Bottom 0.305: v20.35,6.87 19.29,7.93 U1.15
VBAT  (via drill 0.25 pad 0.55)
  Top 0.254: R12.2 46.27,11.5 v46.27,10.02 | U2.A4 44.58,7.61 44.92,7.27 47.92,7.27 v48.66,8
  Bottom 0.254: v46.27,10.02 48.29,8 v48.66,8 49.07,8 R4.1
  pour Bottom (no thermals): 49.51,8.9 50.98,6.25 49.95,5.68 48.56,8.3
VBUS  (via drill 0.35 pad 0.75)
  Top 0.254: R23.2 48.49,12.87 v48.34,12.87
  Bottom 0.254: v48.34,12.87 47.85,13.36 Q1.3 | R18.1 40.72,13.03 43.73,16.05 v47.7,16.05
  Bottom 0.406: R20.1 45.16,19.01 R8.2 v45.8,18.75
  other vias: 49.61,17.64 51.51,17.32 49.45,16.21
  pour Bottom (rank 2, no thermals): 54.05,19.38 50.24,18.43 46.94,18.43 46.94,13.03 48.02,12.4 48.81,12.4 48.81,15.89 51.67,15.89 54.05,15.26
  pour Top (rank 2, no thermals): 54.21,15.1 54.21,19.54 50.24,18.59 46.91,18.59 45.32,20.18 43.26,20.18 43.26,19.54 45,18.11 47.38,15.89 51.51,15.73
VDD  (via drill 0.35 pad 0.75)
  Top 0.406: v8.65,14.62 8.48,14.62 8.16,14.3 4.2,14.3 v2.62,12.72
  Bottom 0.305: U1.31 12.9,14.55 C6.1
  Bottom 0.406: C6.1 11.13,15.15 C7.1 9.28,15.25 v8.65,14.62
  other vias: 21.03,26.05 22.14,26.05 28.97,23.04 30.08,23.04
  pour Top (rank 4, no thermals): 35.64,29.27 30,26.1 15,34.62 0.08,26.05 0.08,8.75 15,-0.14 30.08,8.59 35.1,5.84
  pour Bottom (no thermals): 20.4,26.85 20.4,25.42 25.64,25.42 28.65,22.4 30.88,22.4 30.88,23.67 29.13,23.67 25.95,26.85
  pour Top (no thermals): 33.57,28.12 45,34.62 59.93,26.05 59.93,8.75 45,0.02 44.05,1.76 58.18,10.02 58.18,24.3 58.18,24.94 45.16,32.56 44.84,32.72 34.21,26.69 33.41,27.96
VDDA  (via drill 0.25 pad 0.55)
  other vias: 22.14,21.77 22.78,21.77
  pour Bottom (rank 2, no thermals): 20.71,15.73 20.71,14.3 21.35,14.3 23.1,16.05 23.1,22.08 21.83,22.08 21.83,16.21 21.35,15.73
  pour Top (no thermals): 21.83,23.19 21.83,21.45 23.1,21.45 23.1,23.19
VSSA  (via drill 0.25 pad 0.55, 0.35 pad 0.75)
  other vias: 45.32,8.39 43.1,20.65 42.46,20.65 41.67,20.65 45.64,22.4 44.84,22.4 44.05,22.4 45.64,23.19 44.84,23.19 44.05,23.19 42.3,22.24 42.46,22.88 40.72,25.73 41.67,25.73 38.34,20.81 37.54,20.81 36.75,20.81 38.34,21.61 37.54,21.61 36.75,21.61 35.8,20.02 36.75,20.02 35.8,19.07 36.75,19.07 36.75,18.11 35.8,18.11 57.39,20.34 55.64,19.86 55.8,17.64 57.39,17.48 55.64,14.94 57.39,14.94 56.43,10.34 41.03,5.1 47.23,5.89 36.27,8.27 39.61,27.48 44.84,31.13 51.35,27.16 44.53,27.16 45.16,4.14 54.85,11.29 54.05,25.26 50.72,25.26 47.23,25.26 48.81,23.35 46.91,27.16 37.54,26.69 49.29,20.18
  pour Top (rank 3, no thermals): 35.64,29.15 35.64,5.61 45,0.18 59.93,8.91 59.93,26.05 45.28,34.62
  pour Bottom (rank 3, no thermals): 35.32,29.12 35.32,5.79 45,0.18 59.93,8.91 59.93,26.05 45.14,34.7
  pour Bottom (no thermals): 23.89,17.48 37.23,17.48 37.23,16.21 23.89,16.21
  pour Bottom (no thermals): 23.57,22.4 23.57,16.21 21.51,14.15 20.71,14.15 20.71,13.83 21.67,13.83 22.78,14.94 24.68,14.94 24.68,22.4

### Text on the board
tPlace: 3V3/2A | 3V3/2A | 3V3/2A | 3V3/2A | P1 | P2* | 3V3/2A | PWR_INPUT | C | D | P5* | STAT | R | BAT_INPUT | 3V3/2A | 3V3/2A | 3V3/2A | P3 | P4 | 3V3/2A | 3V3/2A
bPlace: H05R00 | 5.5 V MAX | BAT_N | 4.9 V MAX | BAT_P
tNames: B
bNames: GND | GND | P1 | P2* | GND | GND | GND | P5* | GND | GND | GND | P3 | P4 | GND | GND